# Altium schematic sheet 1G Eternet.SchDoc
size A3; Organization: Altium Limited; Address1: L3, 12a Rodborough Rd; Address2: Frenchs Forest; Address3: NSW; Address4: Australia 2086
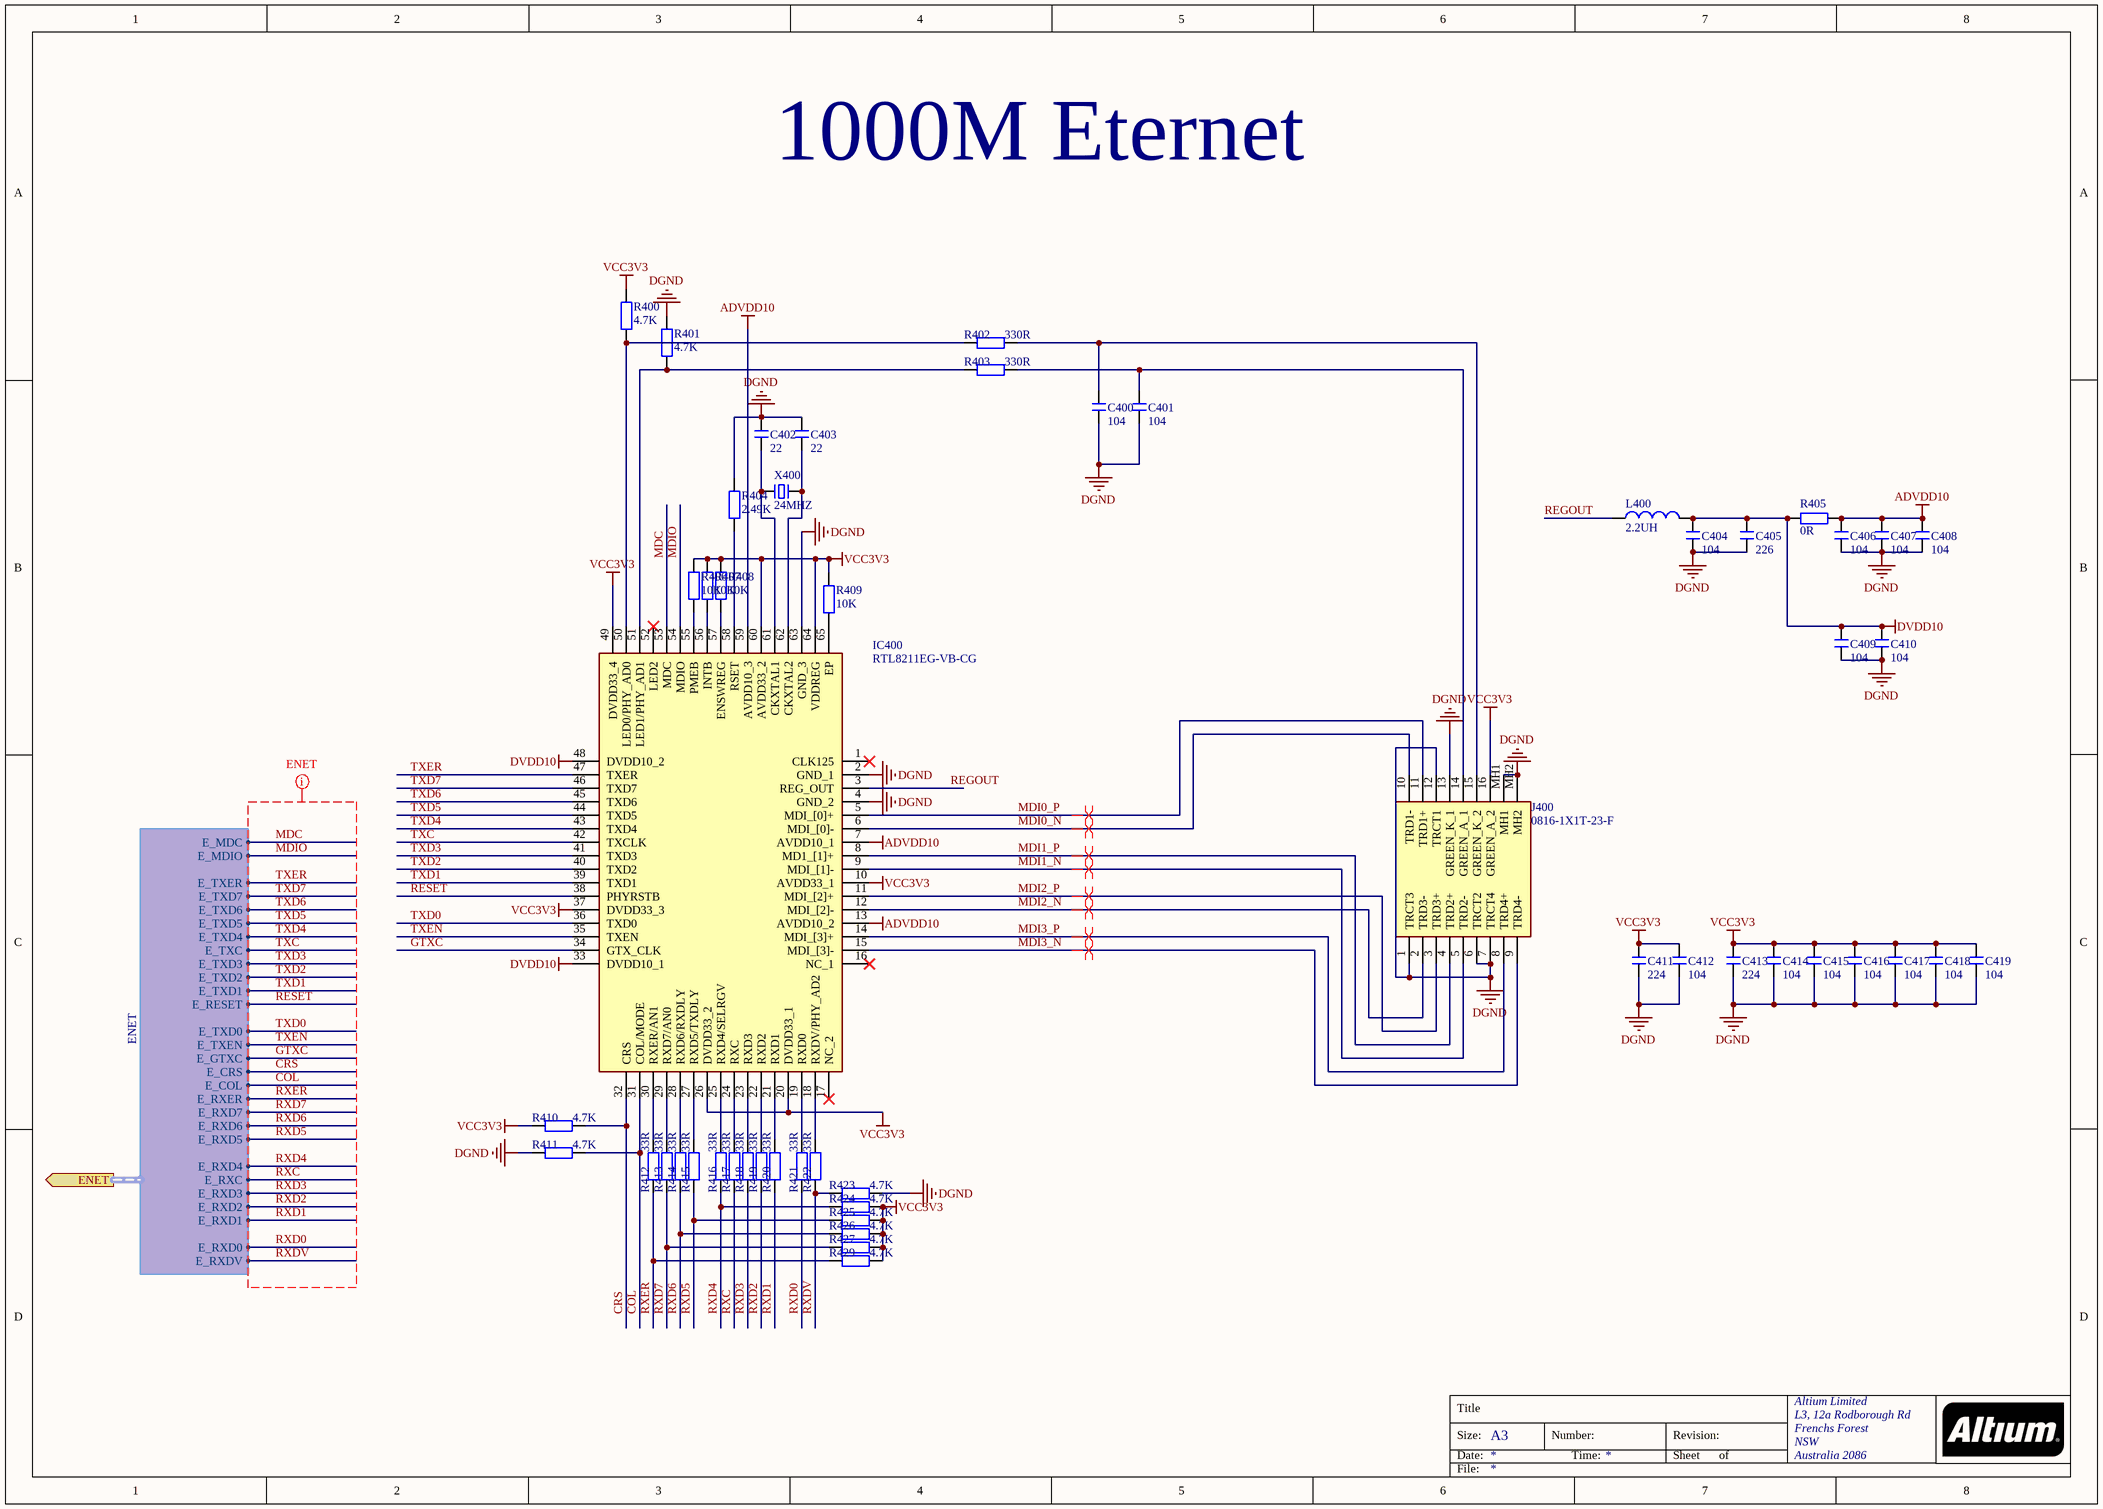
[diagram p0: 1G Eternet.SchDoc]

## Parts
C400  104  [C 0402_M]
C401  104  [C 0402_M]
C402  22  [C 0402_M]
C403  22  [C 0402_M]
C404  104  [C 0402_M]
C405  226  [C 0402_M]
C406  104  [C 0402_M]
C407  104  [C 0402_M]
C408  104  [C 0402_M]
C409  104  [C 0402_M]
C410  104  [C 0402_M]
C411  224  [C 0402_M]
C412  104  [C 0402_M]
C413  224  [C 0402_M]
C414  104  [C 0402_M]
C415  104  [C 0402_M]
C416  104  [C 0402_M]
C417  104  [C 0402_M]
C418  104  [C 0402_M]
C419  104  [C 0402_M]
IC400  RTL8211EG-VB-CG  [QFN50P900X900X100-65N-D]
J400  0816-1X1T-23-F  [08161X1T23F]
L400  2.2UH  [L 0805]
R400  4.7K  [R 0402_M]
R401  4.7K  [R 0402_M]
R402  330R  [R 0402_M]
R403  330R  [R 0402_M]
R404  2.49K  [R 0402_M]
R405  0R  [R 0402_M]
R406  10K  [R 0402_M]
R407  10K  [R 0402_M]
R408  10K  [R 0402_M]
R409  10K  [R 0402_M]
R410  4.7K  [R 0402_M]
R411  4.7K  [R 0402_M]
R412  33R  [R 0402_M]
R413  33R  [R 0402_M]
R414  33R  [R 0402_M]
R415  33R  [R 0402_M]
R416  33R  [R 0402_M]
R417  33R  [R 0402_M]
R418  33R  [R 0402_M]
R419  33R  [R 0402_M]
R420  33R  [R 0402_M]
R421  33R  [R 0402_M]
R422  33R  [R 0402_M]
R423  4.7K  [R 0402_M]
R424  4.7K  [R 0402_M]
R425  4.7K  [R 0402_M]
R426  4.7K  [R 0402_M]
R427  4.7K  [R 0402_M]
R429  4.7K  [R 0402_M]
X400  24MHZ  [OSC 5032-2P]

## Ports
ENET (out, harness ENET)

## Harnesses
ENET: E_RXD7, E_RXD6, E_RXD5, E_RXD4, E_RXD3, E_RXD2, E_RXD1, E_RXD0, E_CRS, E_COL, E_RXDV, E_RXER, E_RXC, E_TXER, E_TXC, E_TXD3, E_TXD2, E_TXD7, E_TXD6, E_TXD5, E_TXD4, E_TXD1, E_RESET, E_TXD0, E_TXEN, E_GTXC, E_MDC, E_MDIO

## Nets
ADVDD10: C406.2 C407.2 C408.2 IC400.7(AVDD10_1) IC400.13(AVDD10_2) IC400.59(AVDD10_3) R405.2
DGND: C400.1 C401.1 C402.2 C403.2 C404.1 C405.1 C406.1 C407.1 C408.1 C409.1 C410.1 C411.1 C412.1 C413.1 C414.1 C415.1 C416.1 C417.1 C418.1 C419.1 IC400.2(GND_1) IC400.4(GND_2) IC400.63(GND_3) J400.1(TRCT3) J400.6(TRCT2) J400.7(TRCT4) J400.12(TRCT1) J400.13(GREEN_K_1) J400.MH1 J400.MH2 R401.1 R404.1 R411.2 R423.2
DVDD10: C404.2 C405.2 C409.2 C410.2 IC400.33(DVDD10_1) IC400.48(DVDD10_2) L400.2 R405.1
VCC3V3: C411.2 C412.2 C413.2 C414.2 C415.2 C416.2 C417.2 C418.2 C419.2 IC400.10(AVDD33_1) IC400.20(DVDD33_1) IC400.26(DVDD33_2) IC400.37(DVDD33_3) IC400.49(DVDD33_4) IC400.60(AVDD33_2) IC400.64(VDDREG) J400.16(GREEN_A_2) R400.1 R406.1 R407.1 R408.1 R409.1 R410.2 R424.2 R425.2 R426.2 R427.2 R429.2
COL: IC400.31(COL/MODE) R411.1 ; port ENET.E_COL
CRS: IC400.32(CRS) R410.1 ; port ENET.E_CRS
GTXC: IC400.34(GTX_CLK) ; port ENET.E_GTXC
MDC: IC400.53(MDC) ; port ENET.E_MDC
MDI0_N: IC400.6(MDI_[0]-) J400.10(TRD1-)
MDI0_P: IC400.5(MDI_[0]+) J400.11(TRD1+)
MDI1_N: IC400.9(MDI_[1]-) J400.5(TRD2-)
MDI1_P: IC400.8(MD1_[1]+) J400.4(TRD2+)
MDI2_N: IC400.12(MDI_[2]-) J400.2(TRD3-)
MDI2_P: IC400.11(MDI_[2]+) J400.3(TRD3+)
MDI3_N: IC400.15(MDI_[3]-) J400.9(TRD4-)
MDI3_P: IC400.14(MDI_[3]+) J400.8(TRD4+)
MDIO: IC400.54(MDIO) ; port ENET.E_MDIO
REGOUT: IC400.3(REG_OUT) L400.1
RESET: IC400.38(PHYRSTB) ; port ENET.E_RESET
RXC: R417.2 ; port ENET.E_RXC
RXD0: R421.2 ; port ENET.E_RXD0
RXD1: R420.2 ; port ENET.E_RXD1
RXD2: R419.2 ; port ENET.E_RXD2
RXD3: R418.2 ; port ENET.E_RXD3
RXD4: R416.2 R424.1 ; port ENET.E_RXD4
RXD5: R415.2 R425.1 ; port ENET.E_RXD5
RXD6: R414.2 R426.1 ; port ENET.E_RXD6
RXD7: R413.2 R427.1 ; port ENET.E_RXD7
RXDV: R422.2 R423.1 ; port ENET.E_RXDV
RXER: R412.2 R429.1 ; port ENET.E_RXER
TXC: IC400.42(TXCLK) ; port ENET.E_TXC
TXD0: IC400.36(TXD0) ; port ENET.E_TXD0
TXD1: IC400.39(TXD1) ; port ENET.E_TXD1
TXD2: IC400.40(TXD2) ; port ENET.E_TXD2
TXD3: IC400.41(TXD3) ; port ENET.E_TXD3
TXD4: IC400.43(TXD4) ; port ENET.E_TXD4
TXD5: IC400.44(TXD5) ; port ENET.E_TXD5
TXD6: IC400.45(TXD6) ; port ENET.E_TXD6
TXD7: IC400.46(TXD7) ; port ENET.E_TXD7
TXEN: IC400.35(TXEN) ; port ENET.E_TXEN
TXER: IC400.47(TXER) ; port ENET.E_TXER
NetC400_2: C400.2 J400.15(GREEN_K_2) R402.1
NetC401_2: C401.2 J400.14(GREEN_A_1) R403.1
NetC402_1: C402.1 IC400.61(CKXTAL1) X400.2
NetC403_1: C403.1 IC400.62(CKXTAL2) X400.1
NetIC400_18: IC400.18(RXDV/PHY_AD2) R422.1
NetIC400_19: IC400.19(RXD0) R421.1
NetIC400_21: IC400.21(RXD1) R420.1
NetIC400_22: IC400.22(RXD2) R419.1
NetIC400_23: IC400.23(RXD3) R418.1
NetIC400_24: IC400.24(RXC) R417.1
NetIC400_25: IC400.25(RXD4/SELRGV) R416.1
NetIC400_27: IC400.27(RXD5/TXDLY) R415.1
NetIC400_28: IC400.28(RXD6/RXDLY) R414.1
NetIC400_29: IC400.29(RXD7/AN0) R413.1
NetIC400_30: IC400.30(RXER/AN1) R412.1
NetIC400_50: IC400.50(LED0/PHY_AD0) R400.2 R402.2
NetIC400_51: IC400.51(LED1/PHY_AD1) R401.2 R403.2
NetIC400_55: IC400.55(PMEB) R406.2
NetIC400_56: IC400.56(INTB) R407.2
NetIC400_57: IC400.57(ENSWREG) R408.2
NetIC400_58: IC400.58(RSET) R404.2
NetIC400_65: IC400.65(EP) R409.2

Not connected (* = marked no-connect by the designer): IC400 1(CLK125)* 16(NC_1)* 17(NC_2)* 52(LED2)*

## Layout directives
differential pair; differential pair class Eternet; rule Matched Net Lengths [Tolerance = 5mil]: MDI0_N, MDI0_P, MDI1_N, MDI1_P, MDI2_N, MDI2_P, MDI3_N, MDI3_P
net class ENET; rule Matched Net Lengths [Tolerance = 100mil]: COL, CRS, GTXC, MDC, MDIO, RESET, RXC, RXD0, RXD1, RXD2, RXD3, RXD4, RXD5, RXD6, RXD7, RXDV, RXER, TXC, TXD0, TXD1, TXD2, TXD3, TXD4, TXD5, TXD6, TXD7, TXEN, TXER

## Notes on the sheet
- 1000M Eternet
- Title
- Size:
- Date:
- A3
- Number:
- Time:
- Revision:
- Sheet
- of
- File:

## Library data of the parts
C400-C419 = C: 无极性贴片电容; 版权归属: 源创客; BOM名称: 无极性贴片电容; 学习资源: www.ooocke.com
IC400 = RTL8211EG-VB-CG: Integrated Circuit; Manufacturer_Name: Realtek; Datasheet Link: http://download3.dvd-driver.cz/realtek/datasheets/pdf/rtl8211e(g)-vb(vl)-cg_datasheet_1.6.pdf; Height: 1mm; Manufacturer_Part_Number: RTL8211EG-VB-CG
J400 = 0816-1X1T-23-F: Connector; Manufacturer_Name: Bel Magnetic Solutions; Datasheet Link: https://componentsearchengine.com/Datasheets/1/0816-1X1T-23-F.pdf; Height: 11.43mm; Manufacturer_Part_Number: 0816-1X1T-23-F; Mouser Part Number: 530-0816-1X1T-23-F; Mouser Price/Stock: https://www.mouser.com/Search/Refine.aspx?Keyword=530-0816-1X1T-23-F
L400 = INDUCTOR
R400-R427 R429 = R: 贴片电阻; 版权归属: 源创客; BOM名称: 贴片电阻; 学习资源: www.ooocke.com
X400 = XTAL-2P: 2脚无源脚晶振; 版权归属: 源创客; BOM名称: 2脚无源脚晶振; 学习资源: www.ooocke.com